# EAGLE schematic MAX31855_Breakout_v10 (EAGLE 6.4)
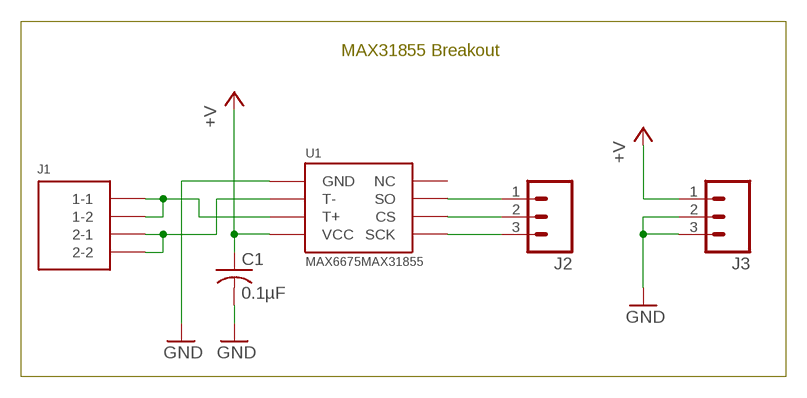
[diagram p0: schematic, sheet 1]

## Parts
C1  0.1µF  C-USC0603  [C0603]
J1  WIRE-TO-BOARD_2PIN_SMD  [WIRE-TO-BOARD_SMD_2WAY]
J2  M031X03_NO_SILK  [1X03_NO_SILK]
J3  M031X03_NO_SILK  [1X03_NO_SILK]
U1  MAX6675MAX31855  [SOIC-8]

## Nets
+5V: C1.1 J3.1 U1.VCC ; supply symbol labelled +V
CS: J2.2 U1.CS
GND: C1.2 J3.2 J3.3 U1.GND
N$1: J1.P2-1(2-1) J1.P2-2(2-2) U1.T-
N$2: J1.P1-1(1-1) J1.P1-2(1-2) U1.T+
SCK: J2.3 U1.SCK
SO: J2.1 U1.SO
Unconnected: U1.NC

## Notes on the sheet
- MAX31855 Breakout

## Library data of the parts
C1 = resistor:C-US: CAPACITOR, American symbol
J1 = McLEng:WIRE-TO-BOARD_2PIN_SMD
J2 J3 = SparkFun:M03: Header 3 Standard 3-pin 0.1" header. Use with straight break away headers (SKU : PRT-00116), right angle break away headers (PRT-00553), swiss pins (PRT-00743), machine pins (PRT-00117), and female headers (PRT-00115). Molex polarized connector foot print use with SKU : PRT-08232 with associated crimp pins and housings.
U1 = McLEng:MAX6675